# Altium project Motor_Driver.PrjPcb
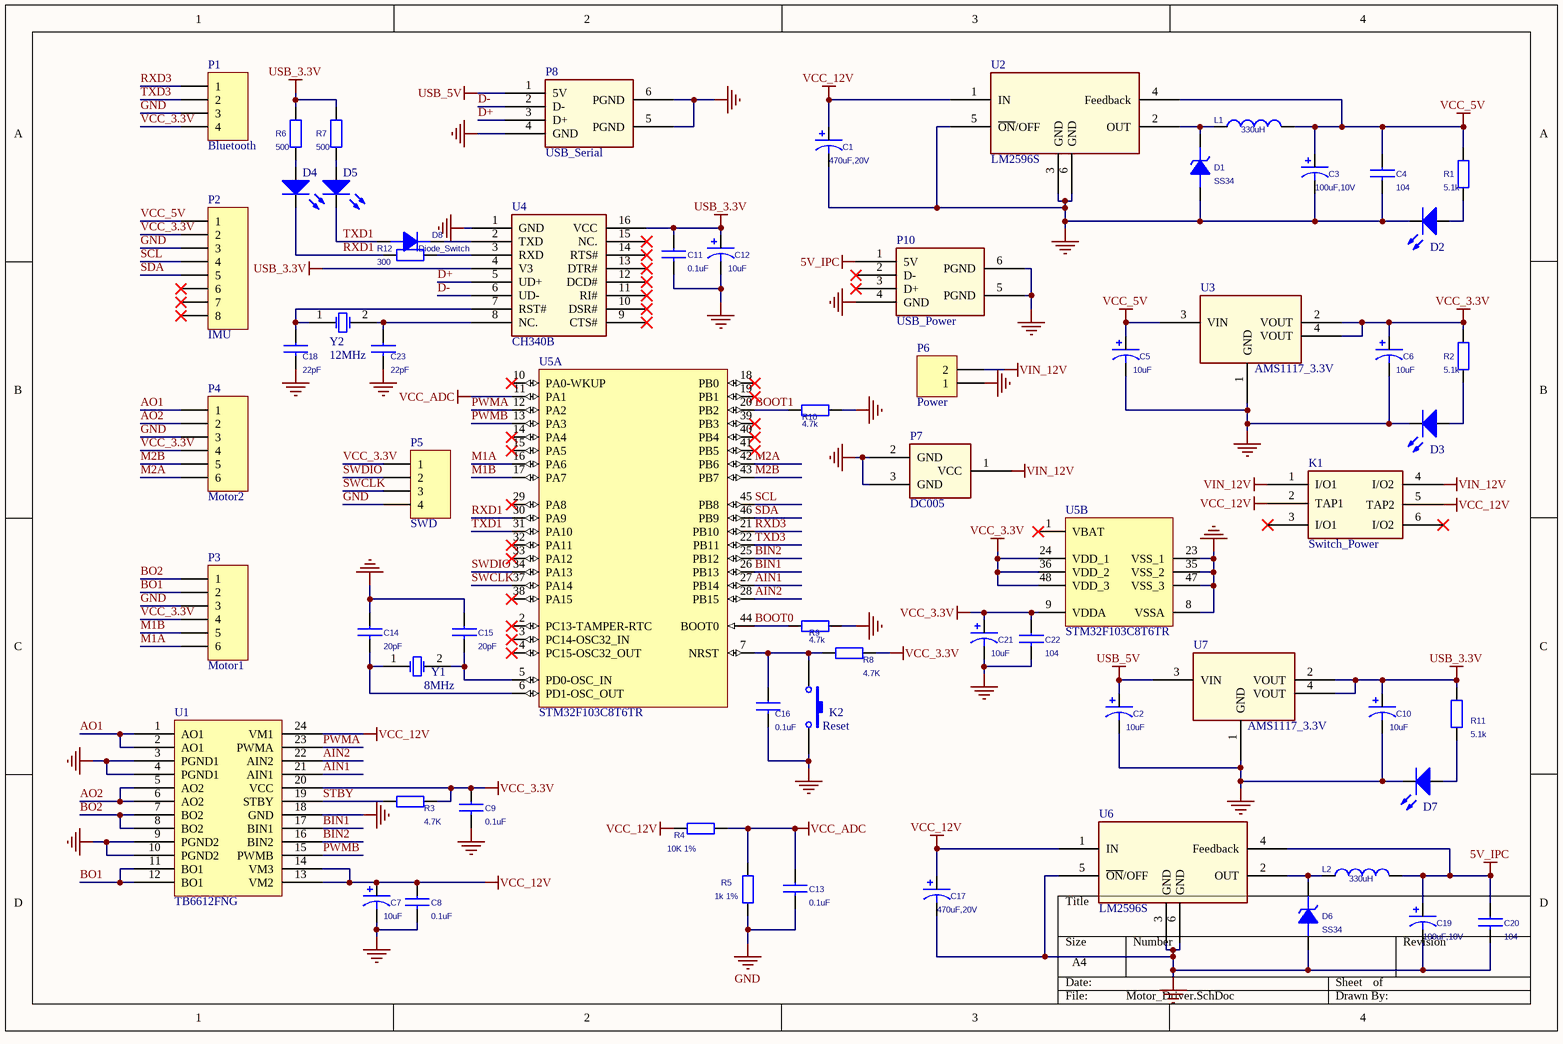
[diagram p0: Motor_Driver.SchDoc]
1 sheet, 65 parts. Net scope: global (net labels, ports and power ports of the same name join across sheets).
Board file: Motor_Driver.PcbDoc

## Sheet Motor_Driver.SchDoc
size A4

### Parts
C1  470uF,20V  [SMD8102_C]
C2  10uF  [CAP_CASE_A_3216]
C3  100uF,10V  [CAP_CASE_C_6032]
C4  104  [0805_C]
C5  10uF  [CAP_CASE_A_3216]
C6  10uF  [CAP_CASE_A_3216]
C7  10uF  [CAP_1.8R2]
C8  0.1uF  [1210_C]
C9  0.1uF  [0805_C]
C10  10uF  [CAP_CASE_A_3216]
C11  0.1uF  [0805_C]
C12  10uF  [CAP_CASE_A_3216]
C13  0.1uF  [0805_C]
C14  20pF  [0805_C]
C15  20pF  [0805_C]
C16  0.1uF  [0805_C]
C17  470uF,20V  [SMD8102_C]
C18  22pF  [0805_C]
C19  100uF,10V  [CAP_CASE_C_6032]
C20  104  [0805_C]
C21  10uF  [CAP_CASE_A_3216]
C22  104  [0805_C]
C23  22pF  [0805_C]
D1  SS34  [SMA]
D2  LED_0603  [LED_0805]  (value not drawn)
D3  LED_0603  [LED_0805]  (value not drawn)
D4  LED_0603  [LED_0805]  (value not drawn)
D5  LED_0603  [LED_0805]  (value not drawn)
D6  SS34  [SMA]
D7  LED_0603  [LED_0805]  (value not drawn)
D8  Diode_Switch  [1206_L]
K1  Switch_Power  [Switch_Key6]
K2  Reset  [SWITCH_KEY2]
L1  330uH  [SMD0707_L]
L2  330uH  [SMD0707_L]
P1  Bluetooth  [Connect_4]
P2  IMU  [HDR1X8]
P3  Motor1  [PH2.0_P6]
P4  Motor2  [PH2.0_P6]
P5  SWD  [Connect_4]
P6  Power  [HT3.96_Power]
P7  DC005  [DC005]
P8  USB_Serial  [USB_Pin6]
P10  USB_Power  [USB_Pin6]
R1  5.1k  [0805_R]
R2  5.1k  [0805_R]
R3  4.7K  [0805_R]
R4  10K 1%  [0805_R]
R5  1k 1%  [0805_R]
R6  500  [0805_R]
R7  500  [0805_R]
R8  4.7K  [0805_R]
R9  4.7k  [0805_R]
R10  4.7k  [0805_R]
R11  5.1k  [0805_R]
R12  300  [0805_R]
U1  TB6612FNG  [TB6612FNG]
U2  LM2596S  [LM2596S]
U3  AMS1117_3.3V  [LM1117]
U4  CH340B  [CH340B]
U5  STM32F103C8T6TR  [STM-LQFP48_N]  (parts A,B of 2)
U6  LM2596S  [LM2596S]
U7  AMS1117_3.3V  [LM1117]
Y1  8MHz  [Xtal_Pin2]
Y2  12MHz  [Xtal_Pin2]

### Nets
5V_IPC: C19.1 C20.1 L2.2 P10.1(5V) U6.4(Feedback)
GND: C1.2 C2.2 C3.2 C4.2 C5.2 C6.2 C7.2 C8.2 C9.2 C10.2 C11.2 C12.2 C13.2 C14.1 C15.1 C16.2 C17.2 C18.2 C19.2 C20.2 C21.2 C22.2 C23.2 D1.2(ANODE) D2.2 D3.2 D6.2(ANODE) D7.2 K2.2 P1.3 P2.3 P3.3 P4.3 P5.4 P6.1 P7.2(GND) P7.3(GND) P8.4(GND) P8.5(PGND) P8.6(PGND) P10.4(GND) P10.5(PGND) P10.6(PGND) R5.1 R9.1 R10.1 U1.3(PGND1) U1.4(PGND1) U1.9(PGND2) U1.10(PGND2) U1.18(GND) U2.3(GND) U2.5(~{ON}/OFF) U2.6(GND) U3.1(GND) U4.1(GND) U5.8(VSSA) U5.23(VSS_1) U5.35(VSS_2) U5.47(VSS_3) U6.3(GND) U6.5(~{ON}/OFF) U6.6(GND) U7.1(GND)
USB_3.3V: C10.1 C11.1 C12.1 R6.2 R7.2 R11.2 U4.4(V3) U4.16(VCC) U7.2(VOUT) U7.4(VOUT)
USB_5V: C2.1 P8.1(5V) U7.3(VIN)
VCC_3.3V: C6.1 C9.1 C21.1 C22.1 P1.4 P2.2 P3.4 P4.4 P5.1 R2.2 R3.1 R8.1 U1.20(VCC) U3.2(VOUT) U3.4(VOUT) U5.9(VDDA) U5.24(VDD_1) U5.36(VDD_2) U5.48(VDD_3)
VCC_5V: C3.1 C4.1 C5.1 L1.2 P2.1 R1.2 U2.4(Feedback) U3.3(VIN)
VCC_12V: C1.1 C7.1 C8.1 C17.1 K1.2(TAP1) K1.5(TAP2) R4.1 U1.13(VM2) U1.14(VM3) U1.24(VM1) U2.1(IN) U6.1(IN)
VCC_ADC: C13.1 R4.2 R5.2 U5.11(PA1)
VIN_12V: K1.1(I/O1) K1.4(I/O2) P6.2 P7.1(VCC)
AIN1: U1.21(AIN1) U5.27(PB14)
AIN2: U1.22(AIN2) U5.28(PB15)
AO1: P4.1 U1.1(AO1) U1.2(AO1)
AO2: P4.2 U1.5(AO2) U1.6(AO2)
BIN1: U1.17(BIN1) U5.26(PB13)
BIN2: U1.16(BIN2) U5.25(PB12)
BO1: P3.2 U1.11(BO1) U1.12(BO1)
BO2: P3.1 U1.7(BO2) U1.8(BO2)
BOOT0: R9.2 U5.44(BOOT0)
BOOT1: R10.2 U5.20(PB2)
D+: P8.3(D+) U4.5(UD+)
D-: P8.2(D-) U4.6(UD-)
M1A: P3.6 U5.16(PA6)
M1B: P3.5 U5.17(PA7)
M2A: P4.6 U5.42(PB6)
M2B: P4.5 U5.43(PB7)
PWMA: U1.23(PWMA) U5.12(PA2)
PWMB: U1.15(PWMB) U5.13(PA3)
RXD1: D4.2 R12.2 U5.30(PA9)
RXD3: P1.1 U5.21(PB10)
SCL: P2.4 U5.45(PB8)
SDA: P2.5 U5.46(PB9)
STBY: R3.2 U1.19(STBY)
SWCLK: P5.3 U5.37(PA14)
SWDIO: P5.2 U5.34(PA13)
TXD1: D5.2 D8.2(A) U5.31(PA10)
TXD3: P1.2 U5.22(PB11)
NetC14_2: C14.2 U5.6(PD1-OSC_OUT) Y1.1(OSC1)
NetC15_2: C15.2 U5.5(PD0-OSC_IN) Y1.2(OSC2)
NetC16_1: C16.1 K2.1 R8.2 U5.7(NRST)
NetC18_1: C18.1 U4.7(RST#) Y2.1(OSC1)
NetC23_1: C23.1 U4.8(NC.) Y2.2(OSC2)
NetD1_1: D1.1(CATHODE) L1.1 U2.2(OUT)
NetD2_1: D2.1 R1.1
NetD3_1: D3.1 R2.1
NetD4_1: D4.1 R6.1
NetD5_1: D5.1 R7.1
NetD6_1: D6.1(CATHODE) L2.1 U6.2(OUT)
NetD7_1: D7.1 R11.1
NetD8_1: D8.1(K) U4.2(TXD)
NetR12_1: R12.1 U4.3(RXD)

Not connected (* = marked no-connect by the designer): K1 3(I/O1)* 6(I/O2)*; P2 6* 7* 8*; P10 2(D-)* 3(D+)*; U4 9(CTS#)* 10(DSR#)* 11(RI#)* 12(DCD#)* 13(DTR#)* 14(RTS#)* 15(NC.)*; U5 1(VBAT)* 2(PC13-TAMPER-RTC)* 3(PC14-OSC32_IN)* 4(PC15-OSC32_OUT)* 10(PA0-WKUP)* 14(PA4)* 15(PA5)* 18(PB0)* 19(PB1)* 29(PA8)* 32(PA11)* 33(PA12)* 38(PA15)* 39(PB3)* 40(PB4)* 41(PB5)*

### Library data of the parts
C1-C3 C5-C7 C10 C12 C17 C19 C21 = Cap_Polar
C4 C8 C9 C11 C13-C16 C18 C20 C22 C23 = Cap
D1 D6 = Diode_Zener
D2-D5 D7 = LED
D8 = Diode_Switch: Vendor: Panasonic
K1 = Switch_Key6
K2 = Switch_Key2
L1 L2 = Inductor
P1 P5 = Connect_4
P2 = Header 8: Header, 8-Pin; LatestRevisionDate: 17-Jul-2002; LatestRevisionNote: Re-released for DXP Platform.; Publisher: Altium Limited
P3 P4 = PH2.0_P6
P6 = HT3.96_Power
P8 P10 = USB_Pin6
R1-R12 = Res
U5 = STM32F103C8T6TR: ARM Cortex-M3 32-bit MCU, 64 KB Flash, 20 KB Internal RAM, 37 I/Os, 48-pin LQFP, -40 to 85 degC, Tape and Reel; A/D Converter: 2x12-bit (10 Channel); FLASH Size (Prog) (kB): 64; I/Os (High Current): 37; Internal RAM Size (kB): 20; Operating Frequency(F) (Processor speed) (MHz): 72; Supply Voltage(Vcc) min (V): 2; DatasheetVersion: Rev. 16; PackageVersion: Rev. 6, 06/2013; PackageReference: LQFP48; PackageDescription: 48-Pin Low Profile Quad Flat Package, 7 x 7 mm Body, 0.5 mm Pitch; Supplier 1: Digi-Key; Supplier Part Number 1: STM32F103C8T6TR-ND; Supplier 2: Mouser; Supplier Part Number 2: 511-STM32F103C8T6TR; Core: ARM Cortex-M3; Packing: Tape and Reel; Mounting Technology: Surface Mount; PartNumber: STM32F103C8T6TR; ComponentLink1Description: Manufacturer URL; ComponentLink1URL: http://www.st.com/web/en/home.html; ComponentLink2Description: Datasheet; ComponentLink2URL: http://www.st.com/st-web-ui/static/active/en/resource/technical/document/datasheet/CD00161566.pdf; ComponentLink3Description: Package Specification; ComponentLink3URL: http://www.st.com/st-web-ui/static/active/en/resource/technical/document/datasheet/DM00058181.pdf
Y1 Y2 = Xtal_Pin2